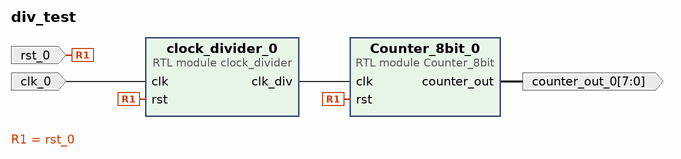
[diagram p0: block diagram of the top level]
# Vivado block design div_test, xc7z020clg400-1, Vivado 2023.2
create_bd_design div_test

create_bd_port -dir O -from 7 -to 0 counter_out_0
create_bd_port -dir I -type rst rst_0
create_bd_port -dir I -type clk clk_0

create_bd_cell -type module -reference clock_divider clock_divider_0
create_bd_cell -type module -reference Counter_8bit Counter_8bit_0

# ---- connections ----

connect_bd_net [get_bd_pins Counter_8bit_0/counter_out] [get_bd_ports counter_out_0]
connect_bd_net -net clk_0_1 [get_bd_ports clk_0] [get_bd_pins clock_divider_0/clk]
connect_bd_net [get_bd_pins clock_divider_0/clk_div] [get_bd_pins Counter_8bit_0/clk]
connect_bd_net -net rst_0_1 [get_bd_ports rst_0] [get_bd_pins clock_divider_0/rst] [get_bd_pins Counter_8bit_0/rst]

validate_bd_design
save_bd_design
